# Vivado block design base, xczu48dr-ffvg1517-2-e, Vivado 2024.1
# (continued, part 2 of 3)
current_bd_instance /radio/receiver/channel_20

create_bd_cell -type ip -vlnv xilinx.com:ip:axi_dma:7.1 axi_dma_imag
set_property -dict [list \
  CONFIG.c_addr_width 64 \
  CONFIG.c_include_mm2s 0 \
  CONFIG.c_include_sg 0 \
  CONFIG.c_s2mm_burst_size 256 \
  CONFIG.c_sg_length_width 26 \
] [get_bd_cells axi_dma_imag]
create_bd_cell -type ip -vlnv xilinx.com:ip:axi_dma:7.1 axi_dma_real
set_property -dict [list \
  CONFIG.c_addr_width 64 \
  CONFIG.c_include_mm2s 0 \
  CONFIG.c_include_sg 0 \
  CONFIG.c_s2mm_burst_size 256 \
  CONFIG.c_sg_length_width 26 \
] [get_bd_cells axi_dma_real]
create_bd_cell -type ip -vlnv xilinx.com:ip:axi_interconnect:2.1 axi_interconnect_hpm
set_property -dict {CONFIG.NUM_MI 3} [get_bd_cells axi_interconnect_hpm]
create_bd_cell -type ip -vlnv xilinx.com:ip:axi_interconnect:2.1 axi_interconnect_hps
set_property -dict [list \
  CONFIG.M00_HAS_DATA_FIFO 0 \
  CONFIG.NUM_MI 1 \
  CONFIG.NUM_SI 2 \
  CONFIG.S00_HAS_DATA_FIFO 0 \
  CONFIG.S01_HAS_DATA_FIFO 0 \
  CONFIG.STRATEGY 0 \
] [get_bd_cells axi_interconnect_hps]
create_bd_cell -type ip -vlnv xilinx.com:ip:axis_clock_converter:1.1 axis_clock_converter_im
set_property -dict {CONFIG.SYNCHRONIZATION_STAGES 5} [get_bd_cells axis_clock_converter_im]
create_bd_cell -type ip -vlnv xilinx.com:ip:axis_clock_converter:1.1 axis_clock_converter_re
set_property -dict {CONFIG.SYNCHRONIZATION_STAGES 5} [get_bd_cells axis_clock_converter_re]
create_bd_cell -type ip -vlnv xilinx.com:ip:xlconcat:2.1 concat_irq
create_bd_cell -type ip -vlnv xilinx.com:ip:packet_generator:1.0 packet_generator
set_property -dict {CONFIG.C_S_AXIS_DATA_WIDTH 128} [get_bd_cells packet_generator]

# ---- hierarchy /radio/receiver/channel_21 ----
current_bd_instance /radio/receiver/channel_21
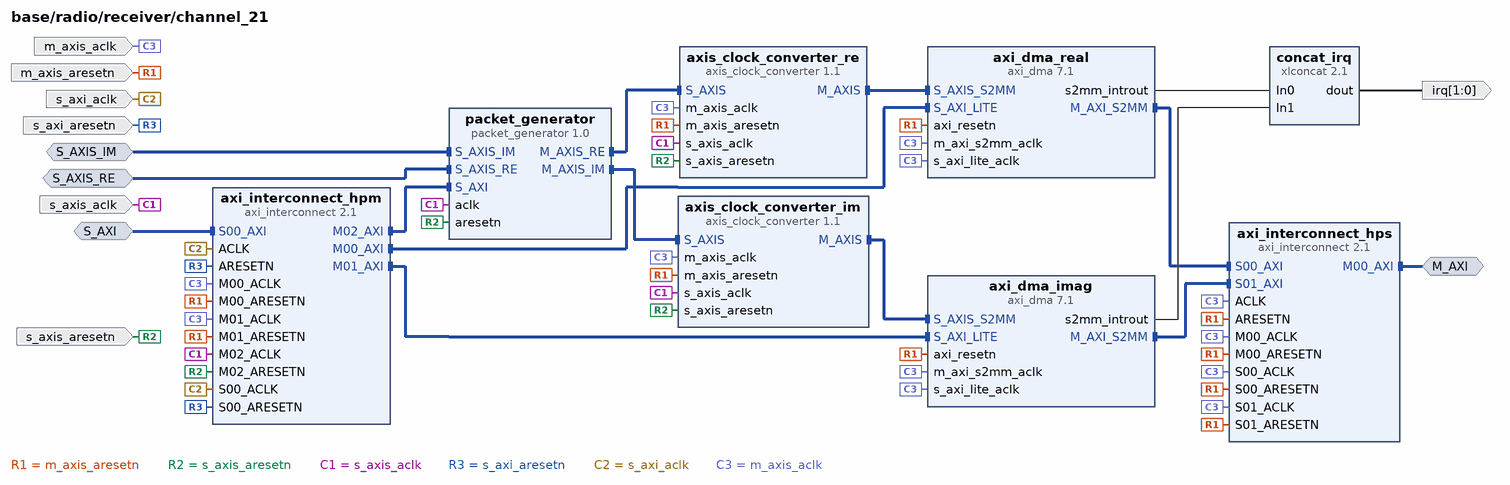
[diagram p11: block diagram inside /radio/receiver/channel_21]
create_bd_intf_pin -mode Master -vlnv xilinx.com:interface:aximm_rtl:1.0 M_AXI
create_bd_intf_pin -mode Slave -vlnv xilinx.com:interface:aximm_rtl:1.0 S_AXI
create_bd_intf_pin -mode Slave -vlnv xilinx.com:interface:axis_rtl:1.0 S_AXIS_IM
create_bd_intf_pin -mode Slave -vlnv xilinx.com:interface:axis_rtl:1.0 S_AXIS_RE
create_bd_pin -dir O -from 1 -to 0 irq
create_bd_pin -dir I -type clk m_axis_aclk
create_bd_pin -dir I -type rst m_axis_aresetn
create_bd_pin -dir I -type clk s_axi_aclk
create_bd_pin -dir I -type rst s_axi_aresetn
create_bd_pin -dir I -type clk s_axis_aclk
create_bd_pin -dir I -type rst s_axis_aresetn

create_bd_cell -type ip -vlnv xilinx.com:ip:axi_dma:7.1 axi_dma_imag
set_property -dict [list \
  CONFIG.c_addr_width 64 \
  CONFIG.c_include_mm2s 0 \
  CONFIG.c_include_sg 0 \
  CONFIG.c_s2mm_burst_size 256 \
  CONFIG.c_sg_length_width 26 \
] [get_bd_cells axi_dma_imag]
create_bd_cell -type ip -vlnv xilinx.com:ip:axi_dma:7.1 axi_dma_real
set_property -dict [list \
  CONFIG.c_addr_width 64 \
  CONFIG.c_include_mm2s 0 \
  CONFIG.c_include_sg 0 \
  CONFIG.c_s2mm_burst_size 256 \
  CONFIG.c_sg_length_width 26 \
] [get_bd_cells axi_dma_real]
create_bd_cell -type ip -vlnv xilinx.com:ip:axi_interconnect:2.1 axi_interconnect_hpm
set_property -dict {CONFIG.NUM_MI 3} [get_bd_cells axi_interconnect_hpm]
create_bd_cell -type ip -vlnv xilinx.com:ip:axi_interconnect:2.1 axi_interconnect_hps
set_property -dict [list \
  CONFIG.M00_HAS_DATA_FIFO 0 \
  CONFIG.NUM_MI 1 \
  CONFIG.NUM_SI 2 \
  CONFIG.S00_HAS_DATA_FIFO 2 \
  CONFIG.S01_HAS_DATA_FIFO 2 \
  CONFIG.STRATEGY 0 \
] [get_bd_cells axi_interconnect_hps]
create_bd_cell -type ip -vlnv xilinx.com:ip:axis_clock_converter:1.1 axis_clock_converter_im
set_property -dict {CONFIG.SYNCHRONIZATION_STAGES 5} [get_bd_cells axis_clock_converter_im]
create_bd_cell -type ip -vlnv xilinx.com:ip:axis_clock_converter:1.1 axis_clock_converter_re
set_property -dict {CONFIG.SYNCHRONIZATION_STAGES 5} [get_bd_cells axis_clock_converter_re]
create_bd_cell -type ip -vlnv xilinx.com:ip:xlconcat:2.1 concat_irq
create_bd_cell -type ip -vlnv xilinx.com:ip:packet_generator:1.0 packet_generator
set_property -dict {CONFIG.C_S_AXIS_DATA_WIDTH 128} [get_bd_cells packet_generator]

# ---- hierarchy /radio/transmitter ----
current_bd_instance /radio/transmitter
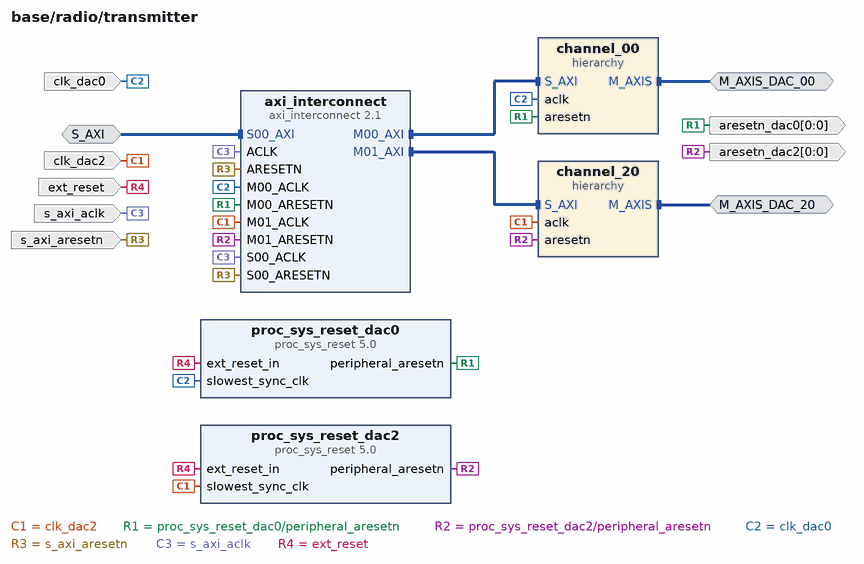
[diagram p12: block diagram inside /radio/transmitter]
create_bd_intf_pin -mode Master -vlnv xilinx.com:interface:axis_rtl:1.0 M_AXIS_DAC_00
create_bd_intf_pin -mode Master -vlnv xilinx.com:interface:axis_rtl:1.0 M_AXIS_DAC_20
create_bd_intf_pin -mode Slave -vlnv xilinx.com:interface:aximm_rtl:1.0 S_AXI
create_bd_pin -dir O -from 0 -to 0 -type rst aresetn_dac0
create_bd_pin -dir O -from 0 -to 0 -type rst aresetn_dac2
create_bd_pin -dir I -type clk clk_dac0
create_bd_pin -dir I -type clk clk_dac2
create_bd_pin -dir I -type rst ext_reset
create_bd_pin -dir I -type clk s_axi_aclk
create_bd_pin -dir I -type rst s_axi_aresetn

create_bd_cell -type ip -vlnv xilinx.com:ip:axi_interconnect:2.1 axi_interconnect
create_bd_cell -type hier channel_00
create_bd_cell -type hier channel_20
create_bd_cell -type ip -vlnv xilinx.com:ip:proc_sys_reset:5.0 proc_sys_reset_dac0
create_bd_cell -type ip -vlnv xilinx.com:ip:proc_sys_reset:5.0 proc_sys_reset_dac2

# ---- hierarchy /radio/transmitter/channel_00 ----
current_bd_instance /radio/transmitter/channel_00
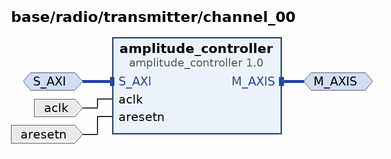
[diagram p13: block diagram inside /radio/transmitter/channel_00]
create_bd_intf_pin -mode Master -vlnv xilinx.com:interface:axis_rtl:1.0 M_AXIS
create_bd_intf_pin -mode Slave -vlnv xilinx.com:interface:aximm_rtl:1.0 S_AXI
create_bd_pin -dir I -type clk aclk
create_bd_pin -dir I -type rst aresetn

create_bd_cell -type ip -vlnv xilinx.com:ip:amplitude_controller:1.0 amplitude_controller
set_property -dict {CONFIG.C_M_AXIS_DATA_WIDTH 256} [get_bd_cells amplitude_controller]

# ---- hierarchy /radio/transmitter/channel_20 ----
current_bd_instance /radio/transmitter/channel_20
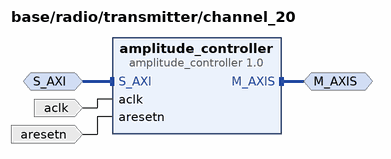
[diagram p14: block diagram inside /radio/transmitter/channel_20]
create_bd_intf_pin -mode Master -vlnv xilinx.com:interface:axis_rtl:1.0 M_AXIS
create_bd_intf_pin -mode Slave -vlnv xilinx.com:interface:aximm_rtl:1.0 S_AXI
create_bd_pin -dir I -type clk aclk
create_bd_pin -dir I -type rst aresetn

create_bd_cell -type ip -vlnv xilinx.com:ip:amplitude_controller:1.0 amplitude_controller
set_property -dict {CONFIG.C_M_AXIS_DATA_WIDTH 256} [get_bd_cells amplitude_controller]

# ---- connections ----

current_bd_instance /CMAC
connect_bd_intf_net [get_bd_intf_pins diff_clock_rtl] [get_bd_intf_pins cmac/gt_ref_clk]
connect_bd_intf_net [get_bd_intf_pins S00_AXI] [get_bd_intf_pins axi_interconnect_cmac/S00_AXI]
connect_bd_intf_net [get_bd_intf_pins S01_AXI] [get_bd_intf_pins axi_interconnect_cmac/S01_AXI]
connect_bd_intf_net [get_bd_intf_pins M00_AXI] [get_bd_intf_pins axi_smc_cmac/M00_AXI]
connect_bd_intf_net [get_bd_intf_pins gt_rtl] [get_bd_intf_pins cmac/gt_serial_port]
connect_bd_intf_net [get_bd_intf_pins axi_dma/M_AXIS_MM2S] [get_bd_intf_pins tx_fifo/S_AXIS]
connect_bd_intf_net [get_bd_intf_pins axi_dma/M_AXI_MM2S] [get_bd_intf_pins axi_smc_cmac/S00_AXI]
connect_bd_intf_net [get_bd_intf_pins axi_dma/M_AXI_S2MM] [get_bd_intf_pins axi_smc_cmac/S01_AXI]
connect_bd_intf_net [get_bd_intf_pins axi_interconnect_cmac/M01_AXI] [get_bd_intf_pins cmac/s_axi]
connect_bd_intf_net [get_bd_intf_pins axi_dma/S_AXI_LITE] [get_bd_intf_pins axi_interconnect_cmac/M00_AXI]
connect_bd_intf_net [get_bd_intf_pins cmac/axis_rx] [get_bd_intf_pins rx_fifo/S_AXIS]
connect_bd_intf_net [get_bd_intf_pins axi_dma/S_AXIS_S2MM] [get_bd_intf_pins rx_fifo/M_AXIS]
connect_bd_intf_net [get_bd_intf_pins cmac/axis_tx] [get_bd_intf_pins tx_fifo/M_AXIS]
connect_bd_net [get_bd_pins ACLK] \
  [get_bd_pins axi_dma/s_axi_lite_aclk] [get_bd_pins axi_dma/m_axi_mm2s_aclk] [get_bd_pins axi_dma/m_axi_s2mm_aclk] \
  [get_bd_pins axi_interconnect_cmac/ACLK] [get_bd_pins axi_interconnect_cmac/S00_ACLK] \
  [get_bd_pins axi_interconnect_cmac/M00_ACLK] [get_bd_pins axi_interconnect_cmac/M01_ACLK] \
  [get_bd_pins axi_interconnect_cmac/S01_ACLK] [get_bd_pins axi_smc_cmac/aclk] [get_bd_pins cmac/s_axi_aclk] \
  [get_bd_pins cmac/init_clk] [get_bd_pins rx_fifo/m_axis_aclk] [get_bd_pins tx_fifo/s_axis_aclk]
connect_bd_net [get_bd_pins ARESETN] \
  [get_bd_pins axi_dma/axi_resetn] [get_bd_pins axi_interconnect_cmac/ARESETN] \
  [get_bd_pins axi_interconnect_cmac/S00_ARESETN] [get_bd_pins axi_interconnect_cmac/M00_ARESETN] \
  [get_bd_pins axi_interconnect_cmac/M01_ARESETN] [get_bd_pins axi_interconnect_cmac/S01_ARESETN] \
  [get_bd_pins axi_smc_cmac/aresetn] [get_bd_pins tx_fifo/s_axis_aresetn]
connect_bd_net [get_bd_pins axi_dma/mm2s_introut] [get_bd_pins irq_concat/In0]
connect_bd_net [get_bd_pins axi_dma/s2mm_introut] [get_bd_pins irq_concat/In1]
connect_bd_net [get_bd_pins cmac/gt_rxusrclk2] [get_bd_pins cmac/rx_clk] [get_bd_pins rx_fifo/s_axis_aclk]
connect_bd_net [get_bd_pins cmac/gt_txusrclk2] [get_bd_pins tx_fifo/m_axis_aclk]
connect_bd_net [get_bd_pins cmac/usr_rx_reset] [get_bd_pins util_vector_logic/Op1]
connect_bd_net [get_bd_pins irq_concat/dout] [get_bd_pins dout]
connect_bd_net [get_bd_pins util_vector_logic/Res] [get_bd_pins rx_fifo/s_axis_aresetn]
connect_bd_net [get_bd_pins xlconstant/dout] \
  [get_bd_pins cmac/gtwiz_reset_tx_datapath] [get_bd_pins cmac/gtwiz_reset_rx_datapath] [get_bd_pins cmac/pm_tick] \
  [get_bd_pins cmac/core_rx_reset] [get_bd_pins cmac/core_tx_reset] [get_bd_pins cmac/core_drp_reset] \
  [get_bd_pins cmac/drp_clk]

current_bd_instance /iop_pmod0
connect_bd_intf_net [get_bd_intf_pins lmb/BRAM_PORTB] [get_bd_intf_pins mb_bram_ctrl/BRAM_PORTA]
connect_bd_intf_net [get_bd_intf_pins M_AXI] [get_bd_intf_pins microblaze_0_axi_periph/M07_AXI]
connect_bd_intf_net [get_bd_intf_pins S_AXI] [get_bd_intf_pins mb_bram_ctrl/S_AXI]
connect_bd_intf_net [get_bd_intf_pins gpio/GPIO] [get_bd_intf_pins io_switch/gpio]
connect_bd_intf_net [get_bd_intf_pins iic/IIC] [get_bd_intf_pins io_switch/iic0]
connect_bd_intf_net [get_bd_intf_pins intc/interrupt] [get_bd_intf_pins mb/INTERRUPT]
connect_bd_intf_net [get_bd_intf_pins mb/M_AXI_DP] [get_bd_intf_pins microblaze_0_axi_periph/S00_AXI]
connect_bd_intf_net [get_bd_intf_pins microblaze_0_axi_periph/M00_AXI] [get_bd_intf_pins spi/AXI_LITE]
connect_bd_intf_net [get_bd_intf_pins iic/S_AXI] [get_bd_intf_pins microblaze_0_axi_periph/M01_AXI]
connect_bd_intf_net [get_bd_intf_pins io_switch/S_AXI] [get_bd_intf_pins microblaze_0_axi_periph/M02_AXI]
connect_bd_intf_net [get_bd_intf_pins gpio/S_AXI] [get_bd_intf_pins microblaze_0_axi_periph/M03_AXI]
connect_bd_intf_net [get_bd_intf_pins microblaze_0_axi_periph/M04_AXI] [get_bd_intf_pins timer/S_AXI]
connect_bd_intf_net [get_bd_intf_pins intc/s_axi] [get_bd_intf_pins microblaze_0_axi_periph/M05_AXI]
connect_bd_intf_net [get_bd_intf_pins intr/S_AXI] [get_bd_intf_pins microblaze_0_axi_periph/M06_AXI]
connect_bd_intf_net [get_bd_intf_pins DEBUG] [get_bd_intf_pins mb/DEBUG]
connect_bd_intf_net [get_bd_intf_pins lmb/DLMB] [get_bd_intf_pins mb/DLMB]
connect_bd_intf_net [get_bd_intf_pins lmb/ILMB] [get_bd_intf_pins mb/ILMB]
connect_bd_intf_net [get_bd_intf_pins io_switch/spi0] [get_bd_intf_pins spi/SPI_0]
connect_bd_net [get_bd_pins dff_en_reset_vector_0/q] [get_bd_pins intr_req]
connect_bd_net -net io_data_i_0_1 [get_bd_pins data_i] [get_bd_pins io_switch/io_data_i]
connect_bd_net -net io_switch_0_timer_i [get_bd_pins io_switch/timer_i] [get_bd_pins timer/capturetrig0]
connect_bd_net [get_bd_pins io_switch/io_data_o] [get_bd_pins data_o]
connect_bd_net [get_bd_pins io_switch/io_tri_o] [get_bd_pins tri_o]
connect_bd_net -net iop_pmoda_intr_ack_1 [get_bd_pins intr_ack] [get_bd_pins dff_en_reset_vector_0/reset]
connect_bd_net -net iop_pmoda_intr_gpio_io_o [get_bd_pins intr/gpio_io_o] [get_bd_pins dff_en_reset_vector_0/en]
connect_bd_net [get_bd_pins logic_1/dout] [get_bd_pins dff_en_reset_vector_0/d] [get_bd_pins rst_clk_wiz_1_100M/ext_reset_in]
connect_bd_net -net mb1_iic_iic2intc_irpt [get_bd_pins iic/iic2intc_irpt] [get_bd_pins intr_concat/In0]
connect_bd_net -net mb1_interrupt_concat_dout [get_bd_pins intr_concat/dout] [get_bd_pins intc/intr]
connect_bd_net -net mb1_spi_ip2intc_irpt [get_bd_pins spi/ip2intc_irpt] [get_bd_pins intr_concat/In1]
connect_bd_net -net mb1_timer_generateout0 [get_bd_pins timer/generateout0] [get_bd_pins io_switch/timer_o]
connect_bd_net -net mb1_timer_interrupt [get_bd_pins timer/interrupt] [get_bd_pins intr_concat/In2]
connect_bd_net -net mb1_timer_pwm0 [get_bd_pins timer/pwm0] [get_bd_pins io_switch/pwm_o]
connect_bd_net -net mb_1_reset_Dout [get_bd_pins aux_reset_in] [get_bd_pins rst_clk_wiz_1_100M/aux_reset_in]
connect_bd_net -net mdm_1_debug_sys_rst [get_bd_pins mb_debug_sys_rst] [get_bd_pins rst_clk_wiz_1_100M/mb_debug_sys_rst]
connect_bd_net -net ps7_0_FCLK_CLK0 [get_bd_pins clk_100M] \
  [get_bd_pins dff_en_reset_vector_0/clk] [get_bd_pins io_switch/s_axi_aclk] [get_bd_pins lmb/LMB_Clk] \
  [get_bd_pins gpio/s_axi_aclk] [get_bd_pins iic/s_axi_aclk] [get_bd_pins intc/s_axi_aclk] [get_bd_pins intr/s_axi_aclk] \
  [get_bd_pins mb/Clk] [get_bd_pins mb_bram_ctrl/s_axi_aclk] [get_bd_pins microblaze_0_axi_periph/ACLK] \
  [get_bd_pins microblaze_0_axi_periph/S00_ACLK] [get_bd_pins microblaze_0_axi_periph/M00_ACLK] \
  [get_bd_pins microblaze_0_axi_periph/M01_ACLK] [get_bd_pins microblaze_0_axi_periph/M02_ACLK] \
  [get_bd_pins microblaze_0_axi_periph/M03_ACLK] [get_bd_pins microblaze_0_axi_periph/M04_ACLK] \
  [get_bd_pins microblaze_0_axi_periph/M05_ACLK] [get_bd_pins microblaze_0_axi_periph/M06_ACLK] \
  [get_bd_pins microblaze_0_axi_periph/M07_ACLK] [get_bd_pins rst_clk_wiz_1_100M/slowest_sync_clk] \
  [get_bd_pins spi/ext_spi_clk] [get_bd_pins spi/s_axi_aclk] [get_bd_pins timer/s_axi_aclk]
connect_bd_net [get_bd_pins rst_clk_wiz_1_100M/bus_struct_reset] [get_bd_pins lmb/SYS_Rst]
connect_bd_net [get_bd_pins rst_clk_wiz_1_100M/interconnect_aresetn] [get_bd_pins microblaze_0_axi_periph/ARESETN]
connect_bd_net [get_bd_pins rst_clk_wiz_1_100M/mb_reset] [get_bd_pins mb/Reset]
connect_bd_net [get_bd_pins rst_clk_wiz_1_100M/peripheral_aresetn] \
  [get_bd_pins peripheral_aresetn] [get_bd_pins gpio/s_axi_aresetn] [get_bd_pins iic/s_axi_aresetn] \
  [get_bd_pins intc/s_axi_aresetn] [get_bd_pins microblaze_0_axi_periph/S00_ARESETN] \
  [get_bd_pins microblaze_0_axi_periph/M00_ARESETN] [get_bd_pins microblaze_0_axi_periph/M01_ARESETN] \
  [get_bd_pins microblaze_0_axi_periph/M02_ARESETN] [get_bd_pins microblaze_0_axi_periph/M03_ARESETN] \
  [get_bd_pins microblaze_0_axi_periph/M04_ARESETN] [get_bd_pins microblaze_0_axi_periph/M05_ARESETN] \
  [get_bd_pins microblaze_0_axi_periph/M06_ARESETN] [get_bd_pins microblaze_0_axi_periph/M07_ARESETN] \
  [get_bd_pins spi/s_axi_aresetn] [get_bd_pins timer/s_axi_aresetn]
connect_bd_net [get_bd_pins s_axi_aresetn] \
  [get_bd_pins io_switch/s_axi_aresetn] [get_bd_pins intr/s_axi_aresetn] [get_bd_pins mb_bram_ctrl/s_axi_aresetn]
set_property HDL_ATTRIBUTE.BMM_INFO_PROCESSOR {microblaze-le > base iop_pmod0/lmb/lmb_bram_if_cntlr} [get_bd_cells mb]
set_property HDL_ATTRIBUTE.KEEP_HIERARCHY yes [get_bd_cells mb]

current_bd_instance /iop_pmod0/lmb
connect_bd_intf_net [get_bd_intf_pins dlmb_v10/LMB_Sl_0] [get_bd_intf_pins lmb_bram_if_cntlr/SLMB1]
connect_bd_intf_net [get_bd_intf_pins BRAM_PORTB] [get_bd_intf_pins lmb_bram/BRAM_PORTB]
connect_bd_intf_net [get_bd_intf_pins lmb_bram/BRAM_PORTA] [get_bd_intf_pins lmb_bram_if_cntlr/BRAM_PORT]
connect_bd_intf_net [get_bd_intf_pins DLMB] [get_bd_intf_pins dlmb_v10/LMB_M]
connect_bd_intf_net [get_bd_intf_pins ILMB] [get_bd_intf_pins ilmb_v10/LMB_M]
connect_bd_intf_net [get_bd_intf_pins ilmb_v10/LMB_Sl_0] [get_bd_intf_pins lmb_bram_if_cntlr/SLMB]
connect_bd_net [get_bd_pins SYS_Rst] [get_bd_pins dlmb_v10/SYS_Rst] [get_bd_pins ilmb_v10/SYS_Rst] [get_bd_pins lmb_bram_if_cntlr/LMB_Rst]
connect_bd_net -net microblaze_0_Clk [get_bd_pins LMB_Clk] \
  [get_bd_pins dlmb_v10/LMB_Clk] [get_bd_pins ilmb_v10/LMB_Clk] [get_bd_pins lmb_bram_if_cntlr/LMB_Clk]
set_property HDL_ATTRIBUTE.BMM_INFO_ADDRESS_SPACE {byte  0x00000000 32 > base iop_pmod0/lmb/lmb_bram} [get_bd_cells lmb_bram_if_cntlr]
set_property HDL_ATTRIBUTE.KEEP_HIERARCHY yes [get_bd_cells lmb_bram_if_cntlr]

current_bd_instance /iop_pmod1
connect_bd_intf_net [get_bd_intf_pins lmb/BRAM_PORTB] [get_bd_intf_pins mb_bram_ctrl/BRAM_PORTA]
connect_bd_intf_net [get_bd_intf_pins M_AXI] [get_bd_intf_pins microblaze_0_axi_periph/M07_AXI]
connect_bd_intf_net [get_bd_intf_pins S_AXI] [get_bd_intf_pins mb_bram_ctrl/S_AXI]
connect_bd_intf_net [get_bd_intf_pins gpio/GPIO] [get_bd_intf_pins io_switch/gpio]
connect_bd_intf_net [get_bd_intf_pins iic/IIC] [get_bd_intf_pins io_switch/iic0]
connect_bd_intf_net [get_bd_intf_pins intc/interrupt] [get_bd_intf_pins mb/INTERRUPT]
connect_bd_intf_net [get_bd_intf_pins mb/M_AXI_DP] [get_bd_intf_pins microblaze_0_axi_periph/S00_AXI]
connect_bd_intf_net [get_bd_intf_pins microblaze_0_axi_periph/M00_AXI] [get_bd_intf_pins spi/AXI_LITE]
connect_bd_intf_net [get_bd_intf_pins iic/S_AXI] [get_bd_intf_pins microblaze_0_axi_periph/M01_AXI]
connect_bd_intf_net [get_bd_intf_pins io_switch/S_AXI] [get_bd_intf_pins microblaze_0_axi_periph/M02_AXI]
connect_bd_intf_net [get_bd_intf_pins gpio/S_AXI] [get_bd_intf_pins microblaze_0_axi_periph/M03_AXI]
connect_bd_intf_net [get_bd_intf_pins microblaze_0_axi_periph/M04_AXI] [get_bd_intf_pins timer/S_AXI]
connect_bd_intf_net [get_bd_intf_pins intc/s_axi] [get_bd_intf_pins microblaze_0_axi_periph/M05_AXI]
connect_bd_intf_net [get_bd_intf_pins intr/S_AXI] [get_bd_intf_pins microblaze_0_axi_periph/M06_AXI]
connect_bd_intf_net [get_bd_intf_pins DEBUG] [get_bd_intf_pins mb/DEBUG]
connect_bd_intf_net [get_bd_intf_pins lmb/DLMB] [get_bd_intf_pins mb/DLMB]
connect_bd_intf_net [get_bd_intf_pins lmb/ILMB] [get_bd_intf_pins mb/ILMB]
connect_bd_intf_net [get_bd_intf_pins io_switch/spi0] [get_bd_intf_pins spi/SPI_0]
connect_bd_net [get_bd_pins dff_en_reset_vector_0/q] [get_bd_pins intr_req]
connect_bd_net -net io_data_i_0_1 [get_bd_pins data_i] [get_bd_pins io_switch/io_data_i]
connect_bd_net -net io_switch_0_timer_i [get_bd_pins io_switch/timer_i] [get_bd_pins timer/capturetrig0]
connect_bd_net [get_bd_pins io_switch/io_data_o] [get_bd_pins data_o]
connect_bd_net [get_bd_pins io_switch/io_tri_o] [get_bd_pins tri_o]
connect_bd_net -net iop_pmoda_intr_ack_1 [get_bd_pins intr_ack] [get_bd_pins dff_en_reset_vector_0/reset]
connect_bd_net -net iop_pmoda_intr_gpio_io_o [get_bd_pins intr/gpio_io_o] [get_bd_pins dff_en_reset_vector_0/en]
connect_bd_net [get_bd_pins logic_1/dout] [get_bd_pins dff_en_reset_vector_0/d] [get_bd_pins rst_clk_wiz_1_100M/ext_reset_in]
connect_bd_net -net mb1_iic_iic2intc_irpt [get_bd_pins iic/iic2intc_irpt] [get_bd_pins intr_concat/In0]
connect_bd_net -net mb1_interrupt_concat_dout [get_bd_pins intr_concat/dout] [get_bd_pins intc/intr]
connect_bd_net -net mb1_spi_ip2intc_irpt [get_bd_pins spi/ip2intc_irpt] [get_bd_pins intr_concat/In1]
connect_bd_net -net mb1_timer_generateout0 [get_bd_pins timer/generateout0] [get_bd_pins io_switch/timer_o]
connect_bd_net -net mb1_timer_interrupt [get_bd_pins timer/interrupt] [get_bd_pins intr_concat/In2]
connect_bd_net -net mb1_timer_pwm0 [get_bd_pins timer/pwm0] [get_bd_pins io_switch/pwm_o]
connect_bd_net -net mb_1_reset_Dout [get_bd_pins aux_reset_in] [get_bd_pins rst_clk_wiz_1_100M/aux_reset_in]
connect_bd_net -net mdm_1_debug_sys_rst [get_bd_pins mb_debug_sys_rst] [get_bd_pins rst_clk_wiz_1_100M/mb_debug_sys_rst]
connect_bd_net -net ps7_0_FCLK_CLK0 [get_bd_pins clk_100M] \
  [get_bd_pins dff_en_reset_vector_0/clk] [get_bd_pins io_switch/s_axi_aclk] [get_bd_pins lmb/LMB_Clk] \
  [get_bd_pins gpio/s_axi_aclk] [get_bd_pins iic/s_axi_aclk] [get_bd_pins intc/s_axi_aclk] [get_bd_pins intr/s_axi_aclk] \
  [get_bd_pins mb/Clk] [get_bd_pins mb_bram_ctrl/s_axi_aclk] [get_bd_pins microblaze_0_axi_periph/ACLK] \
  [get_bd_pins microblaze_0_axi_periph/S00_ACLK] [get_bd_pins microblaze_0_axi_periph/M00_ACLK] \
  [get_bd_pins microblaze_0_axi_periph/M01_ACLK] [get_bd_pins microblaze_0_axi_periph/M02_ACLK] \
  [get_bd_pins microblaze_0_axi_periph/M03_ACLK] [get_bd_pins microblaze_0_axi_periph/M04_ACLK] \
  [get_bd_pins microblaze_0_axi_periph/M05_ACLK] [get_bd_pins microblaze_0_axi_periph/M06_ACLK] \
  [get_bd_pins microblaze_0_axi_periph/M07_ACLK] [get_bd_pins rst_clk_wiz_1_100M/slowest_sync_clk] \
  [get_bd_pins spi/ext_spi_clk] [get_bd_pins spi/s_axi_aclk] [get_bd_pins timer/s_axi_aclk]
connect_bd_net [get_bd_pins rst_clk_wiz_1_100M/bus_struct_reset] [get_bd_pins lmb/SYS_Rst]
connect_bd_net [get_bd_pins rst_clk_wiz_1_100M/interconnect_aresetn] [get_bd_pins microblaze_0_axi_periph/ARESETN]
connect_bd_net [get_bd_pins rst_clk_wiz_1_100M/mb_reset] [get_bd_pins mb/Reset]
connect_bd_net [get_bd_pins rst_clk_wiz_1_100M/peripheral_aresetn] \
  [get_bd_pins peripheral_aresetn] [get_bd_pins gpio/s_axi_aresetn] [get_bd_pins iic/s_axi_aresetn] \
  [get_bd_pins intc/s_axi_aresetn] [get_bd_pins microblaze_0_axi_periph/S00_ARESETN] \
  [get_bd_pins microblaze_0_axi_periph/M00_ARESETN] [get_bd_pins microblaze_0_axi_periph/M01_ARESETN] \
  [get_bd_pins microblaze_0_axi_periph/M02_ARESETN] [get_bd_pins microblaze_0_axi_periph/M03_ARESETN] \
  [get_bd_pins microblaze_0_axi_periph/M04_ARESETN] [get_bd_pins microblaze_0_axi_periph/M05_ARESETN] \
  [get_bd_pins microblaze_0_axi_periph/M06_ARESETN] [get_bd_pins microblaze_0_axi_periph/M07_ARESETN] \
  [get_bd_pins spi/s_axi_aresetn] [get_bd_pins timer/s_axi_aresetn]
connect_bd_net [get_bd_pins s_axi_aresetn] \
  [get_bd_pins io_switch/s_axi_aresetn] [get_bd_pins intr/s_axi_aresetn] [get_bd_pins mb_bram_ctrl/s_axi_aresetn]
set_property HDL_ATTRIBUTE.BMM_INFO_PROCESSOR {microblaze-le > base iop_pmod1/lmb/lmb_bram_if_cntlr} [get_bd_cells mb]
set_property HDL_ATTRIBUTE.KEEP_HIERARCHY yes [get_bd_cells mb]

current_bd_instance /iop_pmod1/lmb
connect_bd_intf_net [get_bd_intf_pins dlmb_v10/LMB_Sl_0] [get_bd_intf_pins lmb_bram_if_cntlr/SLMB1]
connect_bd_intf_net [get_bd_intf_pins BRAM_PORTB] [get_bd_intf_pins lmb_bram/BRAM_PORTB]
connect_bd_intf_net [get_bd_intf_pins lmb_bram/BRAM_PORTA] [get_bd_intf_pins lmb_bram_if_cntlr/BRAM_PORT]
connect_bd_intf_net [get_bd_intf_pins DLMB] [get_bd_intf_pins dlmb_v10/LMB_M]
connect_bd_intf_net [get_bd_intf_pins ILMB] [get_bd_intf_pins ilmb_v10/LMB_M]
connect_bd_intf_net [get_bd_intf_pins ilmb_v10/LMB_Sl_0] [get_bd_intf_pins lmb_bram_if_cntlr/SLMB]
connect_bd_net [get_bd_pins SYS_Rst] [get_bd_pins dlmb_v10/SYS_Rst] [get_bd_pins ilmb_v10/SYS_Rst] [get_bd_pins lmb_bram_if_cntlr/LMB_Rst]
connect_bd_net -net microblaze_0_Clk [get_bd_pins LMB_Clk] \
  [get_bd_pins dlmb_v10/LMB_Clk] [get_bd_pins ilmb_v10/LMB_Clk] [get_bd_pins lmb_bram_if_cntlr/LMB_Clk]
set_property HDL_ATTRIBUTE.BMM_INFO_ADDRESS_SPACE {byte  0x00000000 32 > base iop_pmod1/lmb/lmb_bram} [get_bd_cells lmb_bram_if_cntlr]
set_property HDL_ATTRIBUTE.KEEP_HIERARCHY yes [get_bd_cells lmb_bram_if_cntlr]

current_bd_instance /radio
connect_bd_intf_net [get_bd_intf_pins vout00] [get_bd_intf_pins rfdc/vout00]
connect_bd_intf_net [get_bd_intf_pins adc2_clk] [get_bd_intf_pins rfdc/adc2_clk]
connect_bd_intf_net [get_bd_intf_pins dac2_clk] [get_bd_intf_pins rfdc/dac2_clk]
connect_bd_intf_net [get_bd_intf_pins axi_interconnect_ps/M00_AXI] [get_bd_intf_pins transmitter/S_AXI]
connect_bd_intf_net [get_bd_intf_pins receiver/S_AXIS_ADC_00_IM] [get_bd_intf_pins rfdc/m01_axis]
connect_bd_intf_net [get_bd_intf_pins receiver/S_AXIS_ADC_00_RE] [get_bd_intf_pins rfdc/m00_axis]
connect_bd_intf_net [get_bd_intf_pins receiver/S_AXIS_ADC_01_IM] [get_bd_intf_pins rfdc/m03_axis]
connect_bd_intf_net [get_bd_intf_pins receiver/S_AXIS_ADC_01_RE] [get_bd_intf_pins rfdc/m02_axis]
connect_bd_intf_net [get_bd_intf_pins receiver/S_AXIS_ADC_20_IM] [get_bd_intf_pins rfdc/m21_axis]
connect_bd_intf_net [get_bd_intf_pins receiver/S_AXIS_ADC_20_RE] [get_bd_intf_pins rfdc/m20_axis]
connect_bd_intf_net [get_bd_intf_pins receiver/S_AXIS_ADC_21_IM] [get_bd_intf_pins rfdc/m23_axis]
connect_bd_intf_net [get_bd_intf_pins receiver/S_AXIS_ADC_21_RE] [get_bd_intf_pins rfdc/m22_axis]
connect_bd_intf_net [get_bd_intf_pins axi_interconnect_ps/M01_AXI] [get_bd_intf_pins receiver/S_AXI]
connect_bd_intf_net [get_bd_intf_pins adc0_clk] [get_bd_intf_pins rfdc/adc0_clk]
connect_bd_intf_net [get_bd_intf_pins S_AXI] [get_bd_intf_pins axi_interconnect_ps/S00_AXI]
connect_bd_intf_net [get_bd_intf_pins M_AXI] [get_bd_intf_pins receiver/M_AXI]
connect_bd_intf_net [get_bd_intf_pins axi_interconnect_ps/M02_AXI] [get_bd_intf_pins rfdc/s_axi]
connect_bd_intf_net [get_bd_intf_pins dac0_clk] [get_bd_intf_pins rfdc/dac0_clk]
connect_bd_intf_net [get_bd_intf_pins sysref_in] [get_bd_intf_pins rfdc/sysref_in]
connect_bd_intf_net [get_bd_intf_pins rfdc/s00_axis] [get_bd_intf_pins transmitter/M_AXIS_DAC_00]
connect_bd_intf_net [get_bd_intf_pins rfdc/s20_axis] [get_bd_intf_pins transmitter/M_AXIS_DAC_20]
connect_bd_intf_net [get_bd_intf_pins vout20] [get_bd_intf_pins rfdc/vout20]
connect_bd_intf_net [get_bd_intf_pins vin0_01] [get_bd_intf_pins rfdc/vin0_01]
connect_bd_intf_net [get_bd_intf_pins vin0_23] [get_bd_intf_pins rfdc/vin0_23]
connect_bd_intf_net [get_bd_intf_pins vin2_01] [get_bd_intf_pins rfdc/vin2_01]
connect_bd_intf_net [get_bd_intf_pins vin2_23] [get_bd_intf_pins rfdc/vin2_23]
connect_bd_net -net concat_irq1_dout [get_bd_pins receiver/irq] [get_bd_pins irq]
connect_bd_net -net proc_sys_reset_1_peripheral_aresetn [get_bd_pins m_axi_aresetn] [get_bd_pins receiver/m_axis_aresetn]
connect_bd_net [get_bd_pins receiver/aresetn_adc0] [get_bd_pins rfdc/m0_axis_aresetn]
connect_bd_net [get_bd_pins receiver/aresetn_adc2] [get_bd_pins rfdc/m2_axis_aresetn]
connect_bd_net [get_bd_pins rfdc/clk_dac0] [get_bd_pins transmitter/clk_dac0] [get_bd_pins rfdc/s0_axis_aclk]
connect_bd_net -net rst_ps8_0_99M_peripheral_aresetn [get_bd_pins s_axi_aresetn] \
  [get_bd_pins receiver/s_axi_aresetn] [get_bd_pins transmitter/s_axi_aresetn] [get_bd_pins axi_interconnect_ps/ARESETN] \
  [get_bd_pins axi_interconnect_ps/S00_ARESETN] [get_bd_pins axi_interconnect_ps/M00_ARESETN] \
  [get_bd_pins axi_interconnect_ps/M01_ARESETN] [get_bd_pins axi_interconnect_ps/M02_ARESETN] \
  [get_bd_pins rfdc/s_axi_aresetn]
connect_bd_net [get_bd_pins transmitter/aresetn_dac0] [get_bd_pins rfdc/s0_axis_aresetn]
connect_bd_net [get_bd_pins transmitter/aresetn_dac2] [get_bd_pins rfdc/s2_axis_aresetn]
connect_bd_net -net usp_rf_data_converter_0_clk_adc0 [get_bd_pins rfdc/clk_adc0] [get_bd_pins receiver/clk_adc0] [get_bd_pins rfdc/m0_axis_aclk]
connect_bd_net -net usp_rf_data_converter_0_clk_adc2 [get_bd_pins rfdc/clk_adc2] [get_bd_pins receiver/clk_adc2] [get_bd_pins rfdc/m2_axis_aclk]
connect_bd_net -net usp_rf_data_converter_0_clk_dac2 [get_bd_pins rfdc/clk_dac2] [get_bd_pins transmitter/clk_dac2] [get_bd_pins rfdc/s2_axis_aclk]
connect_bd_net -net zynq_ultra_ps_e_0_pl_clk0 [get_bd_pins s_axi_aclk] \
  [get_bd_pins receiver/s_axi_aclk] [get_bd_pins transmitter/s_axi_aclk] [get_bd_pins axi_interconnect_ps/ACLK] \
  [get_bd_pins axi_interconnect_ps/S00_ACLK] [get_bd_pins axi_interconnect_ps/M00_ACLK] \
  [get_bd_pins axi_interconnect_ps/M01_ACLK] [get_bd_pins axi_interconnect_ps/M02_ACLK] [get_bd_pins rfdc/s_axi_aclk]
connect_bd_net -net zynq_ultra_ps_e_0_pl_clk1 [get_bd_pins m_axi_aclk] [get_bd_pins receiver/m_axis_aclk]
connect_bd_net -net zynq_ultra_ps_e_0_pl_resetn0 [get_bd_pins ext_reset] [get_bd_pins receiver/ext_reset] [get_bd_pins transmitter/ext_reset]

current_bd_instance /radio/receiver
connect_bd_intf_net [get_bd_intf_pins S_AXIS_ADC_01_IM] [get_bd_intf_pins channel_01/S_AXIS_IM]
connect_bd_intf_net [get_bd_intf_pins S_AXIS_ADC_01_RE] [get_bd_intf_pins channel_01/S_AXIS_RE]
connect_bd_intf_net [get_bd_intf_pins S_AXIS_ADC_21_RE] [get_bd_intf_pins channel_21/S_AXIS_RE]
connect_bd_intf_net [get_bd_intf_pins S_AXIS_ADC_21_IM] [get_bd_intf_pins channel_21/S_AXIS_IM]
connect_bd_intf_net [get_bd_intf_pins S_AXI] [get_bd_intf_pins axi_interconnect_hpm/S00_AXI]
connect_bd_intf_net [get_bd_intf_pins S_AXIS_ADC_20_IM] [get_bd_intf_pins channel_20/S_AXIS_IM]
connect_bd_intf_net [get_bd_intf_pins S_AXIS_ADC_20_RE] [get_bd_intf_pins channel_20/S_AXIS_RE]
connect_bd_intf_net [get_bd_intf_pins axi_interconnect_hpm/M01_AXI] [get_bd_intf_pins channel_20/S_AXI]
connect_bd_intf_net [get_bd_intf_pins axi_interconnect_hpm/M00_AXI] [get_bd_intf_pins channel_00/S_AXI]
connect_bd_intf_net [get_bd_intf_pins axi_interconnect_hpm/M02_AXI] [get_bd_intf_pins channel_01/S_AXI]
connect_bd_intf_net [get_bd_intf_pins axi_interconnect_hpm/M03_AXI] [get_bd_intf_pins channel_21/S_AXI]
connect_bd_intf_net [get_bd_intf_pins M_AXI] [get_bd_intf_pins axi_interconnect_hps/M00_AXI]
connect_bd_intf_net [get_bd_intf_pins axi_interconnect_hps/S00_AXI] [get_bd_intf_pins channel_00/M_AXI]
connect_bd_intf_net [get_bd_intf_pins axi_interconnect_hps/S02_AXI] [get_bd_intf_pins channel_01/M_AXI]
connect_bd_intf_net [get_bd_intf_pins axi_interconnect_hps/S01_AXI] [get_bd_intf_pins channel_20/M_AXI]
connect_bd_intf_net [get_bd_intf_pins axi_interconnect_hps/S03_AXI] [get_bd_intf_pins channel_21/M_AXI]
connect_bd_intf_net [get_bd_intf_pins S_AXIS_ADC_00_RE] [get_bd_intf_pins channel_00/S_AXIS_RE]
connect_bd_intf_net [get_bd_intf_pins S_AXIS_ADC_00_IM] [get_bd_intf_pins channel_00/S_AXIS_IM]
connect_bd_net [get_bd_pins channel_01/irq] [get_bd_pins concat_irq/In2]
connect_bd_net -net channel_0_irq [get_bd_pins channel_20/irq] [get_bd_pins concat_irq/In1]
connect_bd_net [get_bd_pins channel_21/irq] [get_bd_pins concat_irq/In3]
connect_bd_net -net concat_irq1_dout [get_bd_pins concat_irq/dout] [get_bd_pins irq]
connect_bd_net -net concat_irq_dout [get_bd_pins channel_00/irq] [get_bd_pins concat_irq/In0]
connect_bd_net -net proc_sys_reset_1_peripheral_aresetn [get_bd_pins m_axis_aresetn] \
  [get_bd_pins channel_00/m_axis_aresetn] [get_bd_pins channel_01/m_axis_aresetn] [get_bd_pins channel_20/m_axis_aresetn] \
  [get_bd_pins channel_21/m_axis_aresetn] [get_bd_pins axi_interconnect_hps/ARESETN] \
  [get_bd_pins axi_interconnect_hps/S00_ARESETN] [get_bd_pins axi_interconnect_hps/M00_ARESETN] \
  [get_bd_pins axi_interconnect_hps/S01_ARESETN] [get_bd_pins axi_interconnect_hps/S02_ARESETN] \
  [get_bd_pins axi_interconnect_hps/S03_ARESETN]
connect_bd_net [get_bd_pins proc_sys_reset_adc0/peripheral_aresetn] \
  [get_bd_pins aresetn_adc0] [get_bd_pins channel_00/s_axis_aresetn] [get_bd_pins channel_01/s_axis_aresetn]
connect_bd_net [get_bd_pins proc_sys_reset_adc2/peripheral_aresetn] \
  [get_bd_pins aresetn_adc2] [get_bd_pins channel_20/s_axis_aresetn] [get_bd_pins channel_21/s_axis_aresetn]
connect_bd_net -net rfdc_clk_adc0 [get_bd_pins clk_adc0] \
  [get_bd_pins channel_00/s_axis_aclk] [get_bd_pins channel_01/s_axis_aclk] \
  [get_bd_pins proc_sys_reset_adc0/slowest_sync_clk]
connect_bd_net -net rfdc_clk_adc2 [get_bd_pins clk_adc2] \
  [get_bd_pins channel_20/s_axis_aclk] [get_bd_pins channel_21/s_axis_aclk] \
  [get_bd_pins proc_sys_reset_adc2/slowest_sync_clk]
connect_bd_net -net rst_ps8_0_99M_peripheral_aresetn [get_bd_pins s_axi_aresetn] \
  [get_bd_pins channel_00/s_axi_aresetn] [get_bd_pins channel_01/s_axi_aresetn] [get_bd_pins channel_20/s_axi_aresetn] \
  [get_bd_pins channel_21/s_axi_aresetn] [get_bd_pins axi_interconnect_hpm/ARESETN] \
  [get_bd_pins axi_interconnect_hpm/S00_ARESETN] [get_bd_pins axi_interconnect_hpm/M00_ARESETN] \
  [get_bd_pins axi_interconnect_hpm/M01_ARESETN] [get_bd_pins axi_interconnect_hpm/M02_ARESETN] \
  [get_bd_pins axi_interconnect_hpm/M03_ARESETN]
connect_bd_net -net zynq_ultra_ps_e_0_pl_clk0 [get_bd_pins s_axi_aclk] \
  [get_bd_pins channel_00/s_axi_aclk] [get_bd_pins channel_01/s_axi_aclk] [get_bd_pins channel_20/s_axi_aclk] \
  [get_bd_pins channel_21/s_axi_aclk] [get_bd_pins axi_interconnect_hpm/ACLK] [get_bd_pins axi_interconnect_hpm/S00_ACLK] \
  [get_bd_pins axi_interconnect_hpm/M00_ACLK] [get_bd_pins axi_interconnect_hpm/M01_ACLK] \
  [get_bd_pins axi_interconnect_hpm/M02_ACLK] [get_bd_pins axi_interconnect_hpm/M03_ACLK]
connect_bd_net -net zynq_ultra_ps_e_0_pl_clk1 [get_bd_pins m_axis_aclk] \
  [get_bd_pins channel_00/m_axis_aclk] [get_bd_pins channel_01/m_axis_aclk] [get_bd_pins channel_20/m_axis_aclk] \
  [get_bd_pins channel_21/m_axis_aclk] [get_bd_pins axi_interconnect_hps/ACLK] [get_bd_pins axi_interconnect_hps/S00_ACLK] \
  [get_bd_pins axi_interconnect_hps/M00_ACLK] [get_bd_pins axi_interconnect_hps/S01_ACLK] \
  [get_bd_pins axi_interconnect_hps/S02_ACLK] [get_bd_pins axi_interconnect_hps/S03_ACLK]
connect_bd_net -net zynq_ultra_ps_e_0_pl_resetn0 [get_bd_pins ext_reset] \
  [get_bd_pins proc_sys_reset_adc0/ext_reset_in] [get_bd_pins proc_sys_reset_adc2/ext_reset_in]

current_bd_instance /radio/receiver/channel_00
connect_bd_intf_net [get_bd_intf_pins axi_dma_real/M_AXI_S2MM] [get_bd_intf_pins axi_interconnect_hps/S00_AXI]
connect_bd_intf_net [get_bd_intf_pins axi_dma_imag/M_AXI_S2MM] [get_bd_intf_pins axi_interconnect_hps/S01_AXI]
connect_bd_intf_net [get_bd_intf_pins S_AXIS_IM] [get_bd_intf_pins packet_generator/S_AXIS_IM]
connect_bd_intf_net [get_bd_intf_pins S_AXIS_RE] [get_bd_intf_pins packet_generator/S_AXIS_RE]
connect_bd_intf_net [get_bd_intf_pins S_AXI] [get_bd_intf_pins axi_interconnect_hpm/S00_AXI]
connect_bd_intf_net [get_bd_intf_pins axi_dma_real/S_AXI_LITE] [get_bd_intf_pins axi_interconnect_hpm/M00_AXI]
connect_bd_intf_net [get_bd_intf_pins axi_dma_imag/S_AXI_LITE] [get_bd_intf_pins axi_interconnect_hpm/M01_AXI]
connect_bd_intf_net [get_bd_intf_pins axi_interconnect_hpm/M02_AXI] [get_bd_intf_pins packet_generator/S_AXI]
connect_bd_intf_net [get_bd_intf_pins M_AXI] [get_bd_intf_pins axi_interconnect_hps/M00_AXI]
connect_bd_intf_net [get_bd_intf_pins axi_dma_imag/S_AXIS_S2MM] [get_bd_intf_pins axis_clock_converter_im/M_AXIS]
connect_bd_intf_net [get_bd_intf_pins axi_dma_real/S_AXIS_S2MM] [get_bd_intf_pins axis_clock_converter_re/M_AXIS]
connect_bd_intf_net [get_bd_intf_pins axis_clock_converter_im/S_AXIS] [get_bd_intf_pins packet_generator/M_AXIS_IM]
connect_bd_intf_net [get_bd_intf_pins axis_clock_converter_re/S_AXIS] [get_bd_intf_pins packet_generator/M_AXIS_RE]
connect_bd_net [get_bd_pins axi_dma_imag/s2mm_introut] [get_bd_pins concat_irq/In1]
connect_bd_net [get_bd_pins axi_dma_real/s2mm_introut] [get_bd_pins concat_irq/In0]
connect_bd_net [get_bd_pins concat_irq/dout] [get_bd_pins irq]
connect_bd_net -net proc_sys_reset_1_peripheral_aresetn [get_bd_pins m_axis_aresetn] \
  [get_bd_pins axi_dma_imag/axi_resetn] [get_bd_pins axi_dma_real/axi_resetn] [get_bd_pins axi_interconnect_hpm/M00_ARESETN] \
  [get_bd_pins axi_interconnect_hpm/M01_ARESETN] [get_bd_pins axi_interconnect_hps/ARESETN] \
  [get_bd_pins axi_interconnect_hps/S00_ARESETN] [get_bd_pins axi_interconnect_hps/M00_ARESETN] \
  [get_bd_pins axi_interconnect_hps/S01_ARESETN] [get_bd_pins axis_clock_converter_im/m_axis_aresetn] \
  [get_bd_pins axis_clock_converter_re/m_axis_aresetn]
connect_bd_net -net proc_sys_reset_adc0_peripheral_aresetn [get_bd_pins s_axis_aresetn] \
  [get_bd_pins packet_generator/aresetn] [get_bd_pins axi_interconnect_hpm/M02_ARESETN] \
  [get_bd_pins axis_clock_converter_im/s_axis_aresetn] [get_bd_pins axis_clock_converter_re/s_axis_aresetn]
connect_bd_net -net rfdc_clk_adc0 [get_bd_pins s_axis_aclk] \
  [get_bd_pins packet_generator/aclk] [get_bd_pins axi_interconnect_hpm/M02_ACLK] \
  [get_bd_pins axis_clock_converter_im/s_axis_aclk] [get_bd_pins axis_clock_converter_re/s_axis_aclk]
connect_bd_net -net rst_ps8_0_99M_peripheral_aresetn [get_bd_pins s_axi_aresetn] \
  [get_bd_pins axi_interconnect_hpm/ARESETN] [get_bd_pins axi_interconnect_hpm/S00_ARESETN]
connect_bd_net -net zynq_ultra_ps_e_0_pl_clk0 [get_bd_pins s_axi_aclk] \
  [get_bd_pins axi_interconnect_hpm/ACLK] [get_bd_pins axi_interconnect_hpm/S00_ACLK]
connect_bd_net -net zynq_ultra_ps_e_0_pl_clk1 [get_bd_pins m_axis_aclk] \
  [get_bd_pins axi_dma_imag/s_axi_lite_aclk] [get_bd_pins axi_dma_imag/m_axi_s2mm_aclk] \
  [get_bd_pins axi_dma_real/s_axi_lite_aclk] [get_bd_pins axi_dma_real/m_axi_s2mm_aclk] \
  [get_bd_pins axi_interconnect_hpm/M00_ACLK] [get_bd_pins axi_interconnect_hpm/M01_ACLK] \
  [get_bd_pins axi_interconnect_hps/ACLK] [get_bd_pins axi_interconnect_hps/S00_ACLK] \
  [get_bd_pins axi_interconnect_hps/M00_ACLK] [get_bd_pins axi_interconnect_hps/S01_ACLK] \
  [get_bd_pins axis_clock_converter_im/m_axis_aclk] [get_bd_pins axis_clock_converter_re/m_axis_aclk]

current_bd_instance /radio/receiver/channel_01
connect_bd_intf_net [get_bd_intf_pins axi_dma_real/M_AXI_S2MM] [get_bd_intf_pins axi_interconnect_hps/S00_AXI]
connect_bd_intf_net [get_bd_intf_pins axi_dma_imag/M_AXI_S2MM] [get_bd_intf_pins axi_interconnect_hps/S01_AXI]
connect_bd_intf_net [get_bd_intf_pins S_AXIS_IM] [get_bd_intf_pins packet_generator/S_AXIS_IM]
connect_bd_intf_net [get_bd_intf_pins S_AXIS_RE] [get_bd_intf_pins packet_generator/S_AXIS_RE]
connect_bd_intf_net [get_bd_intf_pins S_AXI] [get_bd_intf_pins axi_interconnect_hpm/S00_AXI]
connect_bd_intf_net [get_bd_intf_pins axi_dma_real/S_AXI_LITE] [get_bd_intf_pins axi_interconnect_hpm/M00_AXI]
connect_bd_intf_net [get_bd_intf_pins axi_dma_imag/S_AXI_LITE] [get_bd_intf_pins axi_interconnect_hpm/M01_AXI]
connect_bd_intf_net [get_bd_intf_pins axi_interconnect_hpm/M02_AXI] [get_bd_intf_pins packet_generator/S_AXI]
connect_bd_intf_net [get_bd_intf_pins M_AXI] [get_bd_intf_pins axi_interconnect_hps/M00_AXI]
connect_bd_intf_net [get_bd_intf_pins axi_dma_imag/S_AXIS_S2MM] [get_bd_intf_pins axis_clock_converter_im/M_AXIS]
connect_bd_intf_net [get_bd_intf_pins axi_dma_real/S_AXIS_S2MM] [get_bd_intf_pins axis_clock_converter_re/M_AXIS]
connect_bd_intf_net [get_bd_intf_pins axis_clock_converter_im/S_AXIS] [get_bd_intf_pins packet_generator/M_AXIS_IM]
connect_bd_intf_net [get_bd_intf_pins axis_clock_converter_re/S_AXIS] [get_bd_intf_pins packet_generator/M_AXIS_RE]
connect_bd_net [get_bd_pins axi_dma_imag/s2mm_introut] [get_bd_pins concat_irq/In1]
connect_bd_net [get_bd_pins axi_dma_real/s2mm_introut] [get_bd_pins concat_irq/In0]
connect_bd_net [get_bd_pins concat_irq/dout] [get_bd_pins irq]
connect_bd_net -net proc_sys_reset_1_peripheral_aresetn [get_bd_pins m_axis_aresetn] \
  [get_bd_pins axi_dma_imag/axi_resetn] [get_bd_pins axi_dma_real/axi_resetn] [get_bd_pins axi_interconnect_hpm/M00_ARESETN] \
  [get_bd_pins axi_interconnect_hpm/M01_ARESETN] [get_bd_pins axi_interconnect_hps/ARESETN] \
  [get_bd_pins axi_interconnect_hps/S00_ARESETN] [get_bd_pins axi_interconnect_hps/M00_ARESETN] \
  [get_bd_pins axi_interconnect_hps/S01_ARESETN] [get_bd_pins axis_clock_converter_im/m_axis_aresetn] \
  [get_bd_pins axis_clock_converter_re/m_axis_aresetn]
connect_bd_net -net proc_sys_reset_adc0_peripheral_aresetn [get_bd_pins s_axis_aresetn] \
  [get_bd_pins packet_generator/aresetn] [get_bd_pins axi_interconnect_hpm/M02_ARESETN] \
  [get_bd_pins axis_clock_converter_im/s_axis_aresetn] [get_bd_pins axis_clock_converter_re/s_axis_aresetn]
connect_bd_net -net rfdc_clk_adc0 [get_bd_pins s_axis_aclk] \
  [get_bd_pins packet_generator/aclk] [get_bd_pins axi_interconnect_hpm/M02_ACLK] \
  [get_bd_pins axis_clock_converter_im/s_axis_aclk] [get_bd_pins axis_clock_converter_re/s_axis_aclk]
connect_bd_net -net rst_ps8_0_99M_peripheral_aresetn [get_bd_pins s_axi_aresetn] \
  [get_bd_pins axi_interconnect_hpm/ARESETN] [get_bd_pins axi_interconnect_hpm/S00_ARESETN]
connect_bd_net -net zynq_ultra_ps_e_0_pl_clk0 [get_bd_pins s_axi_aclk] \
  [get_bd_pins axi_interconnect_hpm/ACLK] [get_bd_pins axi_interconnect_hpm/S00_ACLK]
connect_bd_net -net zynq_ultra_ps_e_0_pl_clk1 [get_bd_pins m_axis_aclk] \
  [get_bd_pins axi_dma_imag/s_axi_lite_aclk] [get_bd_pins axi_dma_imag/m_axi_s2mm_aclk] \
  [get_bd_pins axi_dma_real/s_axi_lite_aclk] [get_bd_pins axi_dma_real/m_axi_s2mm_aclk] \
  [get_bd_pins axi_interconnect_hpm/M00_ACLK] [get_bd_pins axi_interconnect_hpm/M01_ACLK] \
  [get_bd_pins axi_interconnect_hps/ACLK] [get_bd_pins axi_interconnect_hps/S00_ACLK] \
  [get_bd_pins axi_interconnect_hps/M00_ACLK] [get_bd_pins axi_interconnect_hps/S01_ACLK] \
  [get_bd_pins axis_clock_converter_im/m_axis_aclk] [get_bd_pins axis_clock_converter_re/m_axis_aclk]

current_bd_instance /radio/receiver/channel_20
connect_bd_intf_net [get_bd_intf_pins axi_dma_real/M_AXI_S2MM] [get_bd_intf_pins axi_interconnect_hps/S00_AXI]
connect_bd_intf_net [get_bd_intf_pins axi_dma_imag/M_AXI_S2MM] [get_bd_intf_pins axi_interconnect_hps/S01_AXI]
connect_bd_intf_net [get_bd_intf_pins S_AXIS_IM] [get_bd_intf_pins packet_generator/S_AXIS_IM]
connect_bd_intf_net [get_bd_intf_pins S_AXIS_RE] [get_bd_intf_pins packet_generator/S_AXIS_RE]
connect_bd_intf_net [get_bd_intf_pins S_AXI] [get_bd_intf_pins axi_interconnect_hpm/S00_AXI]
connect_bd_intf_net [get_bd_intf_pins axi_dma_real/S_AXI_LITE] [get_bd_intf_pins axi_interconnect_hpm/M00_AXI]
connect_bd_intf_net [get_bd_intf_pins axi_dma_imag/S_AXI_LITE] [get_bd_intf_pins axi_interconnect_hpm/M01_AXI]
connect_bd_intf_net [get_bd_intf_pins axi_interconnect_hpm/M02_AXI] [get_bd_intf_pins packet_generator/S_AXI]
connect_bd_intf_net [get_bd_intf_pins M_AXI] [get_bd_intf_pins axi_interconnect_hps/M00_AXI]
connect_bd_intf_net [get_bd_intf_pins axi_dma_imag/S_AXIS_S2MM] [get_bd_intf_pins axis_clock_converter_im/M_AXIS]
connect_bd_intf_net [get_bd_intf_pins axi_dma_real/S_AXIS_S2MM] [get_bd_intf_pins axis_clock_converter_re/M_AXIS]
connect_bd_intf_net [get_bd_intf_pins axis_clock_converter_im/S_AXIS] [get_bd_intf_pins packet_generator/M_AXIS_IM]
connect_bd_intf_net [get_bd_intf_pins axis_clock_converter_re/S_AXIS] [get_bd_intf_pins packet_generator/M_AXIS_RE]
connect_bd_net [get_bd_pins axi_dma_imag/s2mm_introut] [get_bd_pins concat_irq/In1]
connect_bd_net [get_bd_pins axi_dma_real/s2mm_introut] [get_bd_pins concat_irq/In0]
connect_bd_net [get_bd_pins concat_irq/dout] [get_bd_pins irq]
connect_bd_net -net proc_sys_reset_1_peripheral_aresetn [get_bd_pins m_axis_aresetn] \
  [get_bd_pins axi_dma_imag/axi_resetn] [get_bd_pins axi_dma_real/axi_resetn] [get_bd_pins axi_interconnect_hpm/M00_ARESETN] \
  [get_bd_pins axi_interconnect_hpm/M01_ARESETN] [get_bd_pins axi_interconnect_hps/ARESETN] \
  [get_bd_pins axi_interconnect_hps/S00_ARESETN] [get_bd_pins axi_interconnect_hps/M00_ARESETN] \
  [get_bd_pins axi_interconnect_hps/S01_ARESETN] [get_bd_pins axis_clock_converter_im/m_axis_aresetn] \
  [get_bd_pins axis_clock_converter_re/m_axis_aresetn]
connect_bd_net -net proc_sys_reset_adc0_peripheral_aresetn [get_bd_pins s_axis_aresetn] \
  [get_bd_pins packet_generator/aresetn] [get_bd_pins axi_interconnect_hpm/M02_ARESETN] \
  [get_bd_pins axis_clock_converter_im/s_axis_aresetn] [get_bd_pins axis_clock_converter_re/s_axis_aresetn]
connect_bd_net -net rfdc_clk_adc0 [get_bd_pins s_axis_aclk] \
  [get_bd_pins packet_generator/aclk] [get_bd_pins axi_interconnect_hpm/M02_ACLK] \
  [get_bd_pins axis_clock_converter_im/s_axis_aclk] [get_bd_pins axis_clock_converter_re/s_axis_aclk]
connect_bd_net -net rst_ps8_0_99M_peripheral_aresetn [get_bd_pins s_axi_aresetn] \
  [get_bd_pins axi_interconnect_hpm/ARESETN] [get_bd_pins axi_interconnect_hpm/S00_ARESETN]
connect_bd_net -net zynq_ultra_ps_e_0_pl_clk0 [get_bd_pins s_axi_aclk] \
  [get_bd_pins axi_interconnect_hpm/ACLK] [get_bd_pins axi_interconnect_hpm/S00_ACLK]
connect_bd_net -net zynq_ultra_ps_e_0_pl_clk1 [get_bd_pins m_axis_aclk] \
  [get_bd_pins axi_dma_imag/s_axi_lite_aclk] [get_bd_pins axi_dma_imag/m_axi_s2mm_aclk] \
  [get_bd_pins axi_dma_real/s_axi_lite_aclk] [get_bd_pins axi_dma_real/m_axi_s2mm_aclk] \
  [get_bd_pins axi_interconnect_hpm/M00_ACLK] [get_bd_pins axi_interconnect_hpm/M01_ACLK] \
  [get_bd_pins axi_interconnect_hps/ACLK] [get_bd_pins axi_interconnect_hps/S00_ACLK] \
  [get_bd_pins axi_interconnect_hps/M00_ACLK] [get_bd_pins axi_interconnect_hps/S01_ACLK] \
  [get_bd_pins axis_clock_converter_im/m_axis_aclk] [get_bd_pins axis_clock_converter_re/m_axis_aclk]
